# EAGLE schematic xt2_redraw (EAGLE 8.5.1)
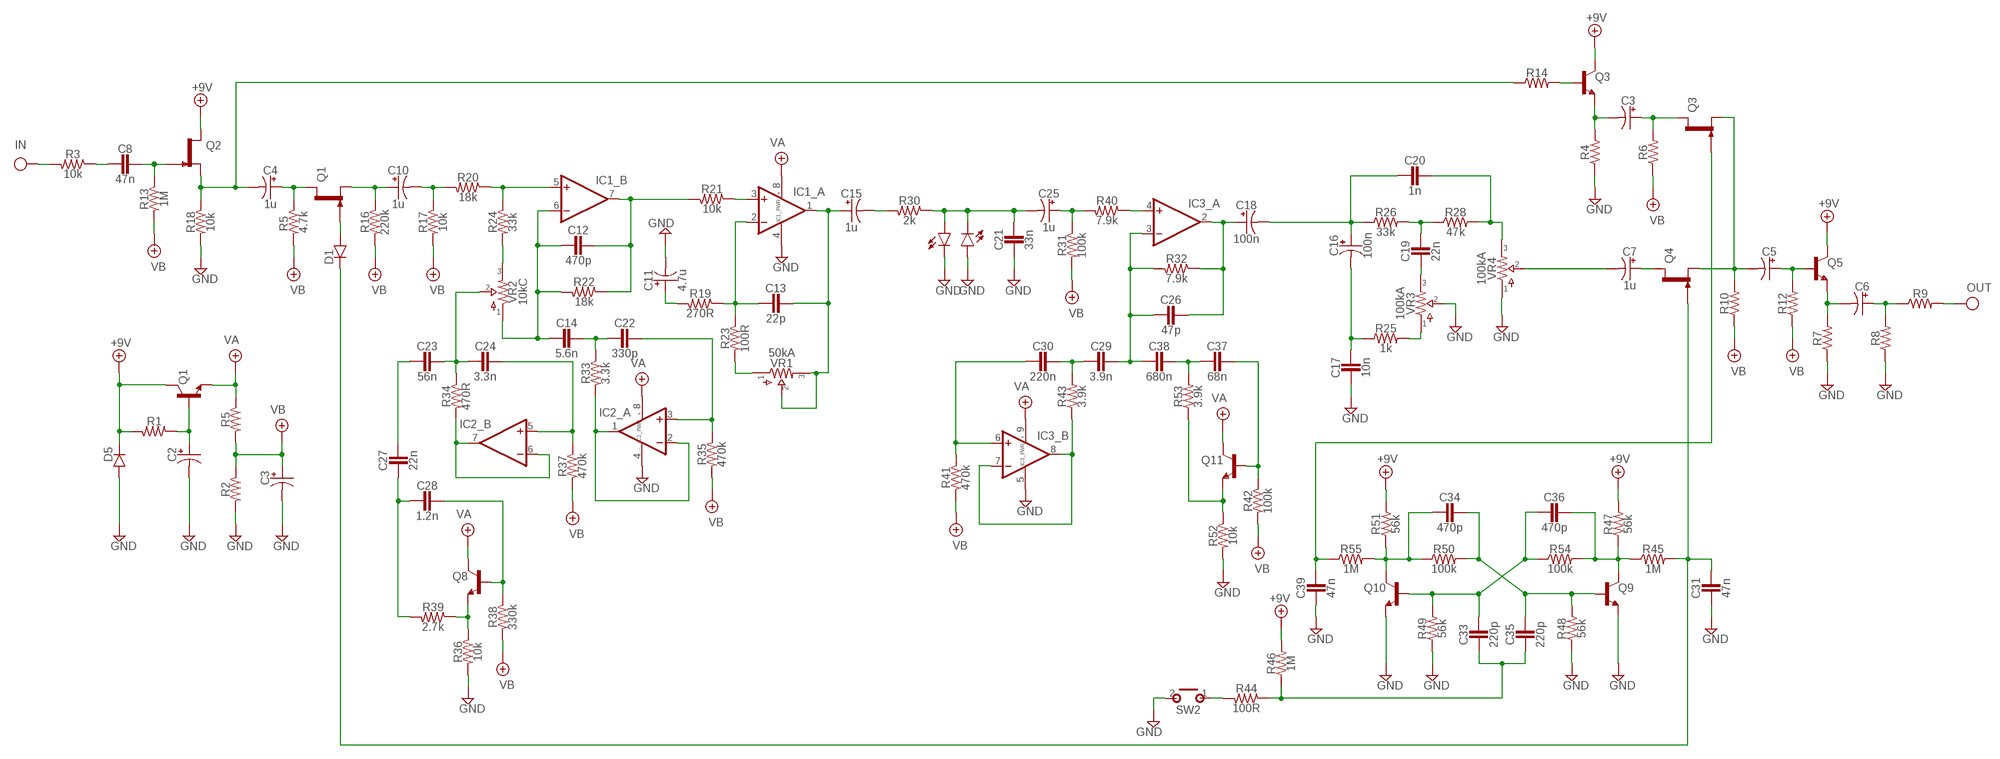
[diagram p0: schematic, sheet 1]

## Parts
C2  0400  [040_020]
C3  0400  [040_020]
C3   0400  [040_020]
C4  1u  0400  [040_020]
C5  0400  [040_020]
C6  0400  [040_020]
C7  1u  0400  [040_020]
C8  47n  CER/FILMBOX.1  [BOX_SMALL]
C10  1u  0400  [040_020]
C11  4.7u  0400  [040_020]
C12  470p  CER/FILMBOX.1  [BOX_SMALL]
C13  22p  CER/FILMBOX.1  [BOX_SMALL]
C14  5.6n  CER/FILMBOX.1  [BOX_SMALL]
C15  1u  0400  [040_020]
C16  100n  0400  [040_020]
C17  10n  CER/FILMBOX.1  [BOX_SMALL]
C18  100n  0400  [040_020]
C19  22n  CER/FILMBOX.1  [BOX_SMALL]
C20  1n  CER/FILMBOX.1  [BOX_SMALL]
C21  33n  CER/FILMBOX.1  [BOX_SMALL]
C22  330p  CER/FILMBOX.1  [BOX_SMALL]
C23  56n  CER/FILMBOX.1  [BOX_SMALL]
C24  3.3n  CER/FILMBOX.1  [BOX_SMALL]
C25  1u  0400  [040_020]
C26  47p  CER/FILMBOX.1  [BOX_SMALL]
C27  22n  CER/FILMBOX.1  [BOX_SMALL]
C28  1.2n  CER/FILMBOX.1  [BOX_SMALL]
C29  3.9n  CER/FILMBOX.1  [BOX_SMALL]
C30  220n  CER/FILMBOX.1  [BOX_SMALL]
C31  47n  CER/FILMBOX.1  [BOX_SMALL]
C33  220p  CER/FILMBOX.1  [BOX_SMALL]
C34  470p  CER/FILMBOX.1  [BOX_SMALL]
C35  220p  CER/FILMBOX.1  [BOX_SMALL]
C36  470p  CER/FILMBOX.1  [BOX_SMALL]
C37  68n  CER/FILMBOX.1  [BOX_SMALL]
C38  680n  CER/FILMBOX.1  [BOX_SMALL]
C39  47n  CER/FILMBOX.1  [BOX_SMALL]
D1  DO35.2  [DO35-2]
D5  DO35.2  [DO35-2]
IC1  DUALTH  [DIL0]
IC2  DUALTH  [DIL0]
IC3  DUAL  [SIL09]
Q1  2N3904  [TO92-]
Q1   2N5457  [TO92-]
Q2  2N5457  [TO92-]
Q3  2N5457  [TO92-]
Q3   2N3904  [TO92-]
Q4  2N5457  [TO92-]
Q5  2N3904  [TO92-]
Q8  2N3904  [TO92-]
Q9  2SC828A  [TO92-]
Q10  2SC828A  [TO92-]
Q11  2N3904  [TO92-]
R1  R_.3B  [R0207/3]
R2  R_.3B  [R0207/3]
R3  10k  R_.3B  [R0207/3]
R4  R_.3B  [R0207/3]
R5  R_.3B  [R0207/3]
R5   4.7k  R_.3B  [R0207/3]
R6  R_.3B  [R0207/3]
R7  R_.3B  [R0207/3]
R8  R_.3B  [R0207/3]
R9  R_.3B  [R0207/3]
R10  R_.3B  [R0207/3]
R12  R_.3B  [R0207/3]
R13  1M  R_.3B  [R0207/3]
R14  R_.3B  [R0207/3]
R16  220k  R_.3B  [R0207/3]
R17  10k  R_.3B  [R0207/3]
R18  10k  R_.3B  [R0207/3]
R19  270R  R_.3B  [R0207/3]
R20  18k  R_.3B  [R0207/3]
R21  10k  R_.3B  [R0207/3]
R22  18k  R_.3B  [R0207/3]
R23  100R  R_.3B  [R0207/3]
R24  33k  R_.3B  [R0207/3]
R25  1k  R_.3B  [R0207/3]
R26  33k  R_.3B  [R0207/3]
R28  47k  R_.3B  [R0207/3]
R30  2k  R_.3B  [R0207/3]
R31  100k  R_.3B  [R0207/3]
R32  7.9k  R_.3B  [R0207/3]
R33  3.3k  R_.3B  [R0207/3]
R34  470R  R_.3B  [R0207/3]
R35  470k  R_.3B  [R0207/3]
R36  10k  R_.3B  [R0207/3]
R37  470k  R_.3B  [R0207/3]
R38  330k  R_.3B  [R0207/3]
R39  2.7k  R_.3B  [R0207/3]
R40  7.9k  R_.3B  [R0207/3]
R41  470k  R_.3B  [R0207/3]
R42  100k  R_.3B  [R0207/3]
R43  3.9k  R_.3B  [R0207/3]
R44  100R  R_.3B  [R0207/3]
R45  1M  R_.3B  [R0207/3]
R46  1M  R_.3B  [R0207/3]
R47  56k  R_.3B  [R0207/3]
R48  56k  R_.3B  [R0207/3]
R49  56k  R_.3B  [R0207/3]
R50  100k  R_.3B  [R0207/3]
R51  56k  R_.3B  [R0207/3]
R52  10k  R_.3B  [R0207/3]
R53  3.9k  R_.3B  [R0207/3]
R54  100k  R_.3B  [R0207/3]
R55  1M  R_.3B  [R0207/3]
SW2  MOMENTARY  [SPST]
VR1  50kA  POTS16MM  [16MM]
VR2  10kC  POTS16MM  [16MM]
VR3  100kA  POTS16MM  [16MM]
VR4  100kA  POTS16MM  [16MM]
   LED  [3MM_D]
    LED  [3MM_D]

## Nets
+9V: D5.C Q1.1(C) Q2.3(D) Q3 .1(C) Q5.1(C) R1.2 R46.2 R47.2 R51.2
GND: C2.- C3.- C11.- C17.2 C21.2 C31.2 C39.2 D5.A IC1.4(_PWR:V-) IC2.4(_PWR:V-) IC3.5(_PWR:V-) Q9.3(E) Q10.3(E) R2.2 R4.1 R7.1 R8.1 R18.2 R36.2 R48.1 R49.1 R52.2 SW2.2(S) VR3.2 VR4.1  .P$1(C)   .ANODE(A)
IN: R3.2
N$1: C4.+ Q1 .3(D) R5 .1
N$2: D1.A Q1 .1(G)
N$3: C8.2 R3.1
N$4: C8.1 Q2.1(G) R13.1
N$5: C2.+ Q1.2(B) R1.1
N$6: C10.+ Q1 .2(S) R16.1
N$7: C10.- R17.1 R20.2
N$8: IC1.5(_B:+IN) R20.1 R24.1
N$9: R24.2 VR2.3
N$10: C12.2 C14.2 IC1.6(_B:-IN) R22.2 VR2.1
N$11: C12.1 IC1.7(_B:OUT) R21.2 R22.1
N$12: C14.1 C22.2 R33.1
N$13: C22.1 IC2.3(_A:+IN) R35.1
N$14: IC2.1(_A:OUT) IC2.2(_A:-IN) R33.2
N$15: C24.1 IC2.5(_B:+IN) R37.1
N$16: IC2.6(_B:-IN) IC2.7(_B:OUT) R34.2
N$17: C23.1 C24.2 R34.1 VR2.2
N$18: C28.1 Q8.2(B) R38.1
N$19: Q8.3(E) R36.1 R39.1
N$20: C27.2 C28.2 R39.2
N$21: C23.2 C27.1
N$22: IC1.3(_A:+IN) R21.1
N$23: C13.2 IC1.2(_A:-IN) R19.1 R23.1
N$24: C11.+ R19.2
N$25: C13.1 C15.+ IC1.1(_A:OUT) VR1.2 VR1.3
N$26: R23.2 VR1.1
N$27: C15.- R30.2
N$28: C21.1 C25.- R30.1  .ANODE(A)   .P$1(C)
N$29: C34.2 Q10.2(C) R50.1 R51.1 R55.2
N$30: C25.+ R31.1 R40.2
N$31: C36.1 Q9.2(C) R45.1 R47.1 R54.2
N$32: C33.1 C36.2 Q10.1(B) R49.2 R54.1
N$33: IC3.4(_A:+IN) R40.1
N$34: C34.1 C35.1 Q9.1(B) R48.2 R50.2
N$35: C33.2 C35.2 R44.1 R46.1
N$36: C26.2 C29.1 C38.2 IC3.3(_A:-IN) R32.2
N$37: C18.+ C26.1 IC3.2(_A:OUT) R32.1
N$38: C37.2 C38.1 R53.2
N$39: C37.1 Q11.2(B) R42.1
N$40: Q11.3(E) R52.1 R53.1
N$41: C29.2 C30.1 R43.2
N$42: IC3.7(_B:-IN) IC3.8(_B:OUT) R43.1
N$43: C16.+ C18.- C20.2 R26.1
N$44: C30.2 IC3.6(_B:+IN) R41.1
N$45: C16.- C17.1 R25.1
N$46: C19.1 R26.2 R28.1
N$47: C20.1 R28.2 VR4.3
N$48: C7.- VR4.2
N$49: C19.2 VR3.3
N$50: R25.2 VR3.1
N$51: C7.+ Q4.3(D)
N$52: C5.- Q3.2(S) Q4.2(S) R10.2
N$53: C3 .+ Q3.3(D) R6.2
N$54: C3 .- Q3 .3(E) R4.2
N$55: Q3 .2(B) R14.2
N$56: C5.+ Q5.2(B) R12.2
N$57: C6.- Q5.3(E) R7.2
N$58: C6.+ R8.2 R9.1
N$59: C31.1 D1.C Q4.1(G) R45.2
N$60: C39.1 Q3.1(G) R55.1
N$85: R44.2 SW2.1(P)
N$139: C4.- Q2.2(S) R14.1 R18.1
OUT: R9.2
VA: IC1.8(_PWR:V+) IC2.8(_PWR:V+) IC3.9(_PWR:V+) Q1.3(E) Q8.1(C) Q11.1(C) R5.1
VB: C3.+ R2.1 R5.2 R5 .2 R6.1 R10.1 R12.1 R13.2 R16.2 R17.2 R31.2 R35.2 R37.2 R38.2 R41.2 R42.2

## Library data of the parts
C2 C3 C3  C4-C7 C10 C11 C15 C16 C18 C25 = pedals-capacitors-elec:040
C8 C12-C14 C17 C19-C24 C26-C31 C33-C39 = pedals-capacitors-film:CER/FILM: 47 - 120pF Xicon Ceramic Disc 2.5mm lead spacing
D1 D5 = pedals-diodes:DO35: DO-35 Package Diodes: 1N914
IC1-IC3 = pedals-integrated circuits:DUAL: OP AMP
Q1 Q3  Q5 Q8 Q11 = pedals-transistors:2N3904: NPN Transistor
Q1  Q2-Q4 = pedals-transistors:2N5457: N-CHANNEL JFET
Q9 Q10 = pedals-transistors:2SC828A
R1-R5 R5  R6-R10 R12-R14 R16-R26 R28 R30-R55 = pedals-resistors:R_
SW2 = pedals-switches:MOMENTARY
VR1-VR4 = pedals-potentiometers:POTS
     = pedals-diodes:LED